# EAGLE design esp07_prog (EAGLE 7.6.0)
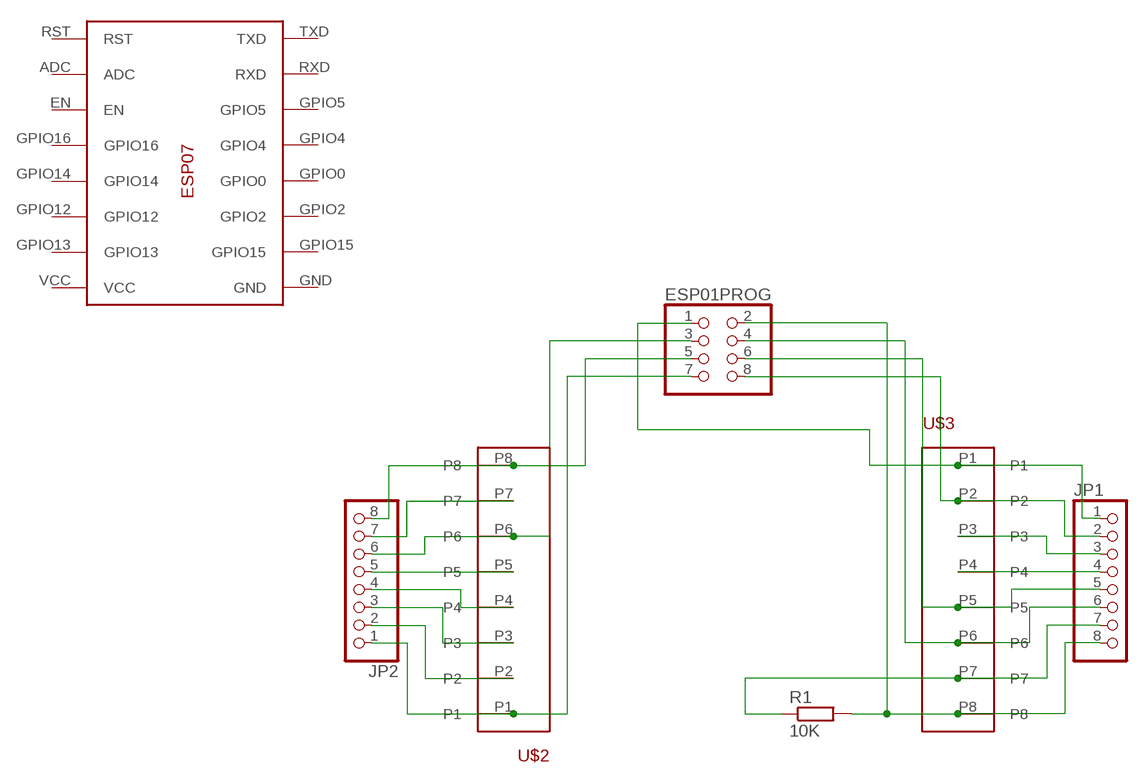
[diagram p0: schematic, sheet 1]

## Parts
ESP01PROG  PINHD-2X4  [2X04]
JP1  PINHD-1X8  [1X08]
JP2  PINHD-1X8  [1X08]
R1  10K  R-EU_0204/7  [0204/7]
U$1  ESP07  [ESP07]
U$2  PINHD8X2MM  [PINHD8X2MM]
U$3  PINHD8X2MM  [PINHD8X2MM]

## Nets
N$1: ESP01PROG.5 JP2.8 U$2.P8
N$2: JP2.7 U$2.P7
N$3: ESP01PROG.3 JP2.6 U$2.P6
N$4: JP2.5 U$2.P5
N$5: JP2.4 U$2.P4
N$6: JP2.3 U$2.P3
N$7: JP2.2 U$2.P2
N$8: ESP01PROG.7 JP2.1 U$2.P1
N$9: ESP01PROG.1 JP1.1 U$3.P1
N$10: ESP01PROG.8 JP1.2 U$3.P2
N$11: JP1.3 U$3.P3
N$12: JP1.4 U$3.P4
N$13: ESP01PROG.6 JP1.5 U$3.P5
N$14: ESP01PROG.4 JP1.6 U$3.P6
N$15: ESP01PROG.2 JP1.8 R1.2 U$3.P8
N$16: JP1.7 R1.1 U$3.P7
Unconnected: U$1.ADC U$1.EN U$1.GND U$1.GPIO0 U$1.GPIO2 U$1.GPIO4 U$1.GPIO5 U$1.GPIO12 U$1.GPIO13 U$1.GPIO14 U$1.GPIO15 U$1.GPIO16 U$1.RST U$1.RXD U$1.TXD U$1.VCC

## Library data of the parts
ESP01PROG = pinhead:PINHD-2X4: PIN HEADER
JP1 JP2 = pinhead:PINHD-1X8: PIN HEADER
R1 = rcl:R-EU_: RESISTOR, European symbol
U$1 = esp07adapter:ESP07
U$2 U$3 = esp07adapter:PINHD8X2MM

## Board
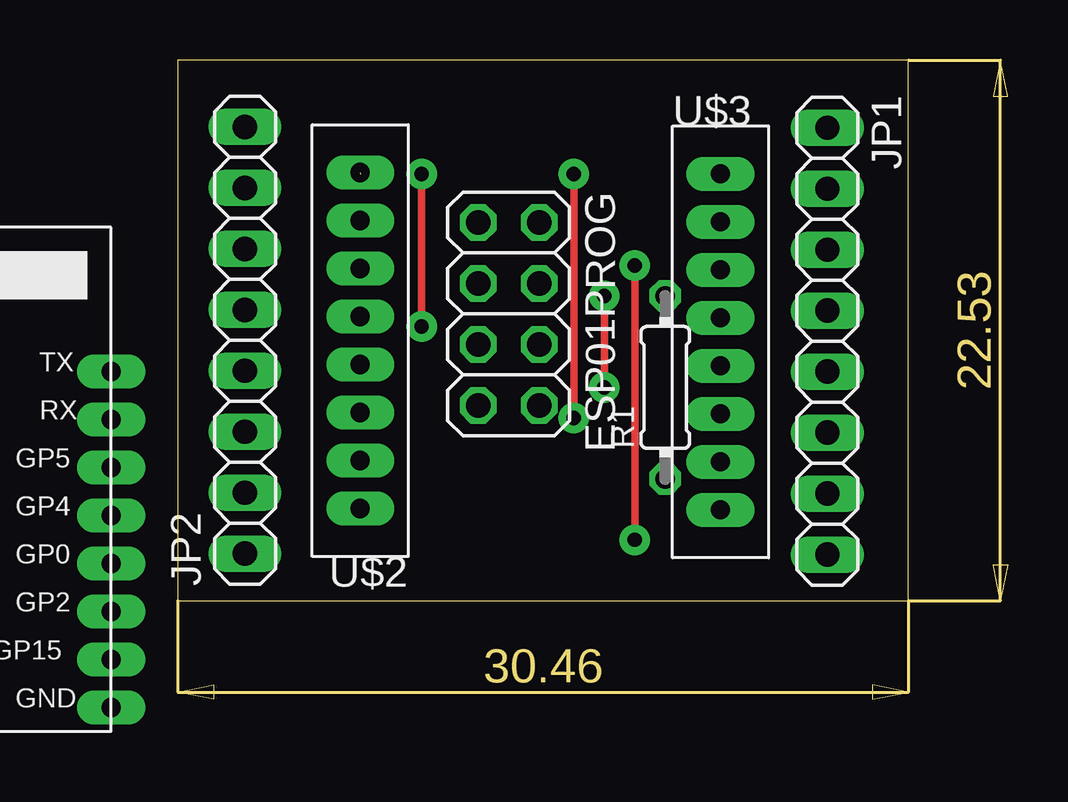
[diagram p1: board, top side]
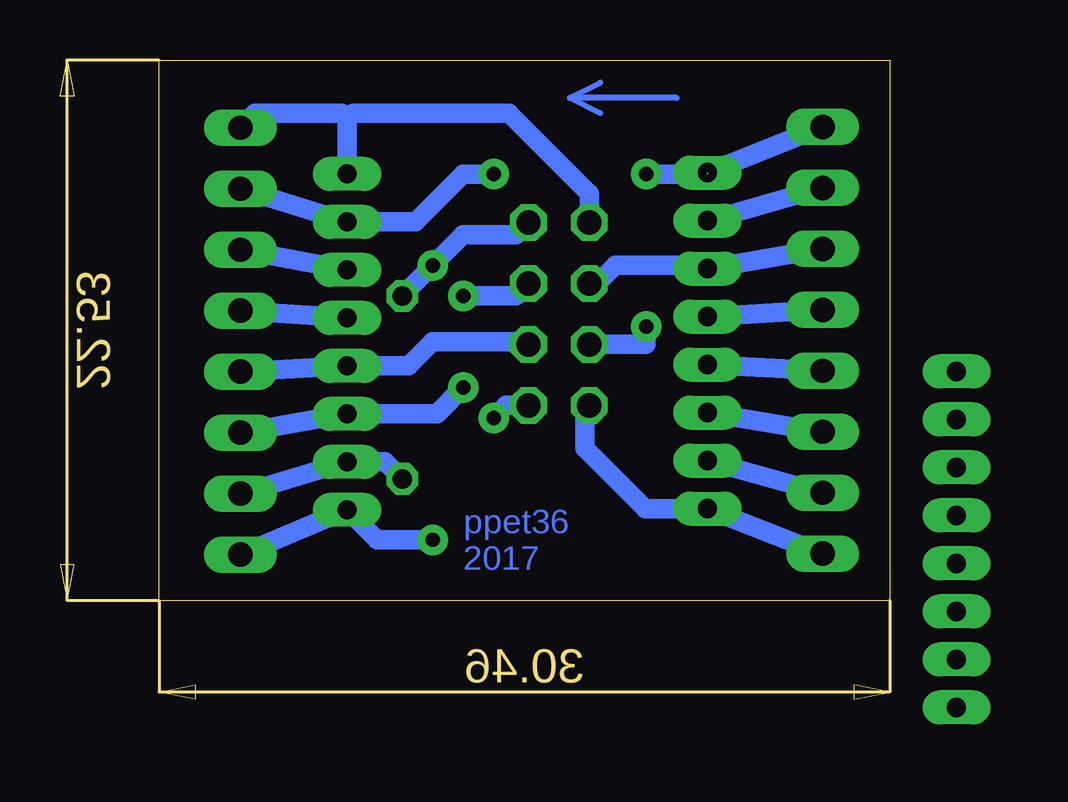
[diagram p2: board, bottom side, seen from below]

Size 30.46 x 22.53 mm. Coordinates in mm from the lower left corner, seen from the top.
Outline: 0,0 30.46,0 30.46,22.53 0,22.53 0,0
Copper layers (1*16): Top 0.035mm / dielectric 1.5mm / Bottom 0.035mm
Design rules "default": minimum track width 10mil, minimum drill 24mil, track to track 8mil, track to pad 8mil, pad to pad 8mil, via to via 8mil, smd to smd 8mil, copper to edge 40mil, drill to drill 8mil, minimum pad ring 10mil, minimum via ring 8mil, stop-mask expansion 4mil, vias tented up to drill 0mil, thermal gap 10mil

### Footprints (pad centres in the part's own frame; a part is rotated, then mirrored left to right if it is on the bottom)
2X04 = drill 1.016 octagon: 1 -3.81,-1.27; 2 -3.81,1.27; 3 -1.27,-1.27; 4 -1.27,1.27; 5 1.27,-1.27; 6 1.27,1.27; 7 3.81,-1.27; 8 3.81,1.27
1X08 = drill 1.016 long: 1 -8.89,0; 2 -6.35,0; 3 -3.81,0; 4 -1.27,0; 5 1.27,0; 6 3.81,0; 7 6.35,0; 8 8.89,0
0204/7 = drill 0.813 octagon: 1 -3.81,0; 2 3.81,0
ESP07 = drill 0.8 pad 1.422 long: ADC 0,12; EN 0,10; GND 15,0; GPIO0 15,6; GPIO2 15,4; GPIO4 15,8; GPIO5 15,10; GPIO12 0,4; GPIO13 0,2; GPIO14 0,6; GPIO15 15,2; GPIO16 0,8; RST 0,14; RXD 15,12; TXD 15,14; VCC 0,0
PINHD8X2MM = drill 0.8 pad 1.422 long: P1 0,8; P2 0,6; P3 0,4; P4 0,2; P5 0,0; P6 0,-2; P7 0,-4; P8 0,-6

### Placement (x,y rotation side)
ESP01PROG  13.79,11.95 270 top
JP1  27.07,10.81 270 top
JP2  2.8,10.85 90 top
R1  20.32,8.89 90 top
U$1  -17.78,-4.45 0 top
U$2  7.6,11.84 180 top
U$3  22.62,9.79 0 top

### Tracks (layer width: path | path; a pad name or v marks a point on that pad's centre or on a via)
N$1  (via drill 0.6 pad 1.27)  (1 unrouted)
  Top 0.305: v10.16,11.43 v10.16,17.78
  Bottom 0.813: ESP01PROG.5 10.16,10.68 v10.16,11.43 | v10.16,17.78 7.62,17.78 | JP2.8 U$2.P8
N$2
  Bottom 0.813: JP2.7 U$2.P7
N$3
  Bottom 0.813: ESP01PROG.3 12.18,13.22 11.43,13.97 7.73,13.97 U$2.P6 JP2.6
N$4
  Bottom 0.813: JP2.5 U$2.P5
N$5
  Bottom 0.813: JP2.4 U$2.P4
N$6
  Bottom 0.813: JP2.3 U$2.P3
N$7
  Bottom 0.813: JP2.2 U$2.P2
N$8
  Bottom 0.813: JP2.1 U$2.P1 10.19,3.84 12.7,6.35 12.7,7.96 ESP01PROG.7
N$9
  Bottom 0.813: JP1.1 26.46,20.32 22.86,20.32 22.62,20.08 | U$3.P1 22.62,20.08 | ESP01PROG.1 12.52,16.96 15.88,20.32 22.38,20.32 22.62,20.08
N$10  (via drill 0.6 pad 1.27)
  Top 0.305: v16.51,7.62 v16.51,17.78
  Bottom 0.813: ESP01PROG.8 15.99,8.14 v16.51,7.62 | v16.51,17.78 17.78,17.78 19.77,15.79 U$3.P2 JP1.2
N$11
  Bottom 0.813: U$3.P3 JP1.3
N$12
  Bottom 0.813: U$3.P4 JP1.4
N$13
  Bottom 0.813: ESP01PROG.6 15.58,10.79 19.05,10.79 20.05,9.79 U$3.P5 JP1.5
N$14  (via drill 0.6 pad 1.27)
  Top 0.305: v17.78,12.7 v17.78,8.89
  Bottom 0.813: ESP01PROG.4 15.58,12.7 v17.78,12.7 | v17.78,8.89 18.88,7.79 U$3.P6 JP1.6
N$15  (via drill 0.6 pad 1.27)
  Top 0.305: v19.05,13.97 v19.05,2.54
  Bottom 0.813: ESP01PROG.2 15.58,15.24 17.78,15.24 v19.05,13.97 R1.2 | v19.05,2.54 21.37,2.54 U$3.P8 JP1.8
N$16
  Bottom 0.813: R1.1 21.03,5.79 U$3.P7 JP1.7
N$17
  Bottom 0.254: 8.89,20.95 13.34,20.95 | 13.34,20.95 12.06,20.32 | 13.34,20.95 12.06,21.59

### Text on the board
Bottom: ppet36 / 2017